# Altium schematic sheet Power.SchDoc
size A
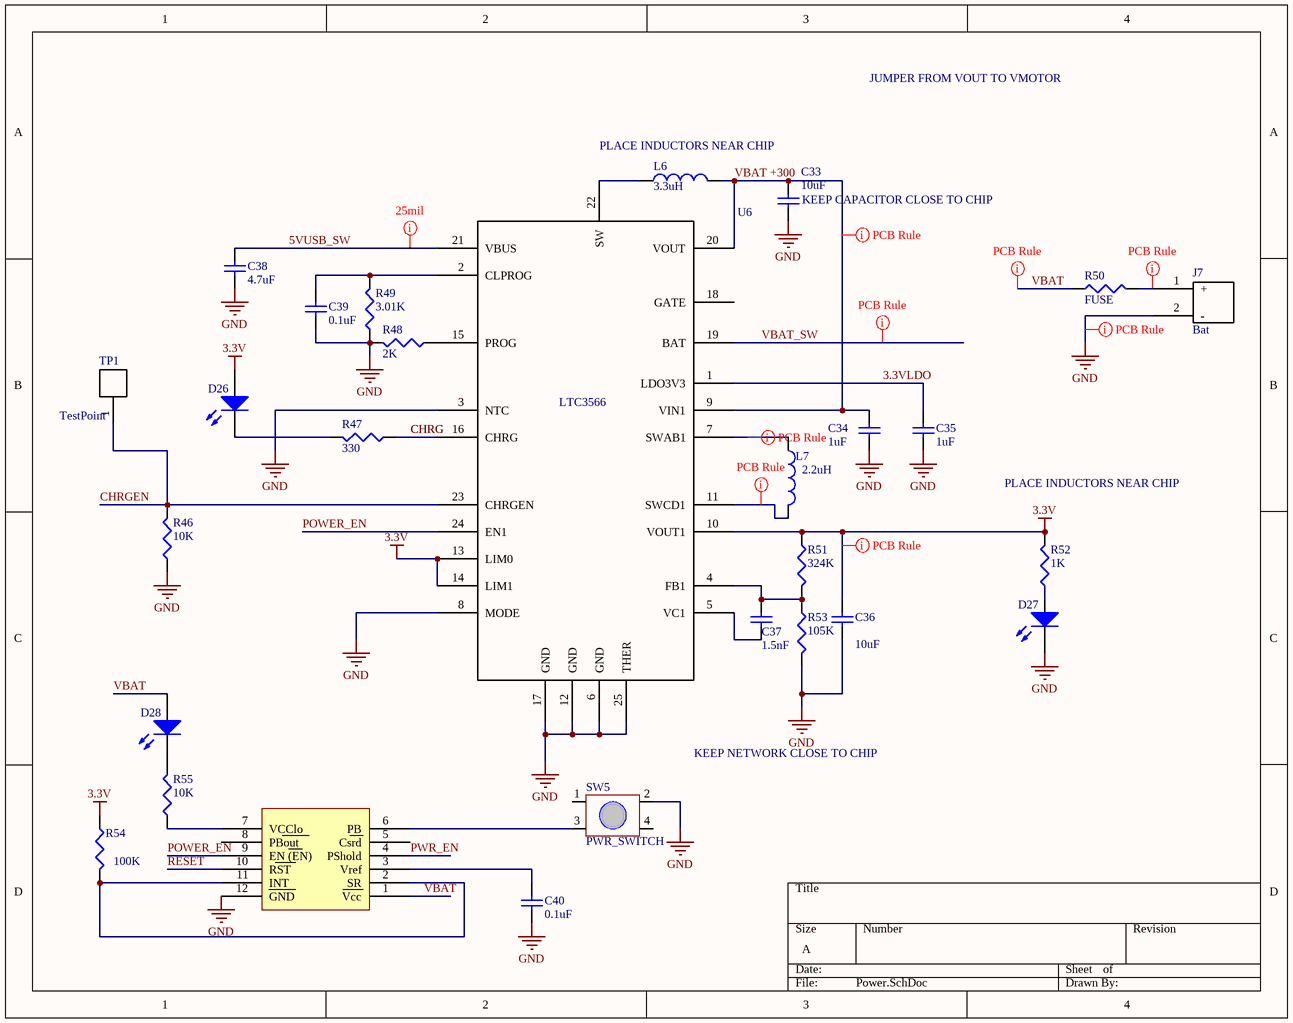
[diagram p0: Power.SchDoc]

## Parts
C33  value 10uF  [CAPC1608L]  (hidden comment: Cap)
C34  value 1uF  [CAPC1608L]  (hidden comment: Cap)
C35  value 1uF  [CAPC1608L]  (hidden comment: Cap)
C36  value 10uF  [CAPC1608L]  (hidden comment: Cap)
C37  value 1.5nF  [CAPC1005L]  (hidden comment: Cap)
C38  value 4.7uF  [CAPC1608L]  (hidden comment: Cap)
C39  value 0.1uF  [CAPC1005L]  (hidden comment: Cap)
C40  value 0.1uF  [CAPC1608L]  (hidden comment: Cap)
D26  Charge  [INDC2012L]  (value not drawn)
D27  Power  [INDC2012L]  (value not drawn)
D28  Charge  [INDC2012L]  (value not drawn)
J7  Bat  [BatteryConnJST]
L6  3.3uH  [IndPow]
L7  2.2uH  [IndPow]
R46  value 10K  [RESC1608L]  (hidden comment: Res3)
R47  value 330  [RESC1608L]  (hidden comment: Res3)
R48  value 2K  [RESC1608L]  (hidden comment: Res3)
R49  value 3.01K  [RESC1608L]  (hidden comment: Res3)
R50  value FUSE  [RESC3225L]  (hidden comment: Res3)
R51  value 324K  [RESC1608L]  (hidden comment: Res3)
R52  value 1K  [RESC1608L]  (hidden comment: Res3)
R53  value 105K  [RESC1608L]  (hidden comment: Res3)
R54  value 100K  [RESC1608L]  (hidden comment: Res3)
R55  value 10K  [RESC1608L]  (hidden comment: Res3)
SW5  PWR_SWITCH  [SwitchTall-TL330]
TP1  TestPoint  [TestPoint]
U6  LTC3566  [QFN-24]
U7  STM6601  [TDFN12]  (value not drawn)

## Nets
3.3V: C36.2 D26.1(A) R51.1 R52.2 R54.1 U6.10(VOUT1) U6.13(LIM0) U6.14(LIM1)
GND: C33.1 C34.2 C35.2 C36.1 C38.1 C39.1 C40.1 D27.2(K) J7.2(-) R46.1 R48.2 R49.1 R53.2 SW5.2 U6.3(NTC) U6.6(GND) U6.8(MODE) U6.12(GND) U6.17(GND) U6.25(THER) U7.12(GND)
3.3VLDO: C35.1 U6.1(LDO3V3)
5VUSB_SW: C38.2 U6.21(VBUS)
CHRG: R47.1 U6.16(CHRG)
CHRGEN: R46.2 TP1.1 U6.23(CHRGEN)
POWER_EN: U6.24(EN1) U7.9(EN_(EN))
PWR_EN: U7.4(PShold)
RESET: U7.10(RST)
VBAT: D28.1(A) R50.1 U7.1(Vcc)
VBAT +300: C33.2 C34.1 L6.2 U6.9(VIN1) U6.20(VOUT)
VBAT_SW: U6.19(BAT)
NetC37_1: C37.1 R51.2 R53.1 U6.4(FB1)
NetC37_2: C37.2 U6.5(VC1)
NetC39_2: C39.2 R49.2 U6.2(CLPROG)
NetC40_2: C40.2 U7.3(Vref)
NetD26_2: D26.2(K) R47.2
NetD27_1: D27.1(A) R52.1
NetD28_2: D28.2(K) R55.2
NetJ7_1: J7.1(+) R50.2
NetL6_1: L6.1 U6.22(SW)
NetL7_1: L7.1 U6.7(SWAB1)
NetL7_2: L7.2 U6.11(SWCD1)
NetR48_1: R48.1 U6.15(PROG)
NetR54_2: R54.2 U7.2(SR) U7.11(INT)
NetR55_1: R55.1 U7.7(VCClo)
NetSW5_3: SW5.3 U7.6(PB)

Not connected (* = marked no-connect by the designer): SW5 1 4; U6 18(GATE); U7 5(Csrd) 8(PBout)

## Layout directives
rule Width Constraint [Pref Width = 25mil    Min Width = 10mil    Max Width = 25mil]: 5VUSB_SW, GND, NetJ7_1, NetL7_1, NetL7_2, VBAT, VBAT +300
rule Width Constraint [Pref Width = 25mil    Min Width = 10mil    Max Width = 100mil]: 3.3V
rule Width Constraint [Pref Width = 25mil    Min Width = 10mil    Max Width = 50mil]: VBAT_SW

## Notes on the sheet
- JUMPER FROM VOUT TO VMOTOR
- (near L6) PLACE INDUCTORS NEAR CHIP
- (near C33) KEEP CAPACITOR CLOSE TO CHIP
- CHRG
- PLACE INDUCTORS NEAR CHIP
- KEEP NETWORK CLOSE TO CHIP

## Library data of the parts
C33-C40 = Cap: Capacitor; Published: 8-Jun-2000; LatestRevisionDate: 17-Jul-2002; LatestRevisionNote: Re-released for DXP Platform.; PackageReference: RAD-0.3; Publisher: Altium Limited
D26-D28 = LED2: Typical RED, GREEN, YELLOW, AMBER GaAs LED; Published: 8-Jun-2000; LatestRevisionDate: 17-Jul-2002; LatestRevisionNote: Re-released for DXP Platform.; PackageVersion: Feb-2002; PackageReference: 3.2X1.6X1.1; Publisher: Altium Limited
J7 = BatteryConnJST
L6 L7 = Inductor
  L6: Value: 3.3uH
  L7: Value: 2.2uH
R46-R55 = Res3: Resistor; Published: 8-Jun-2000; LatestRevisionDate: 29-May-2009; LatestRevisionNote: IPC-7351 Footprint Added.; PackageReference: J1-0603; Publisher: Altium Limited; PackageDescription: Chip Resistor
SW5 = Switch-TL330